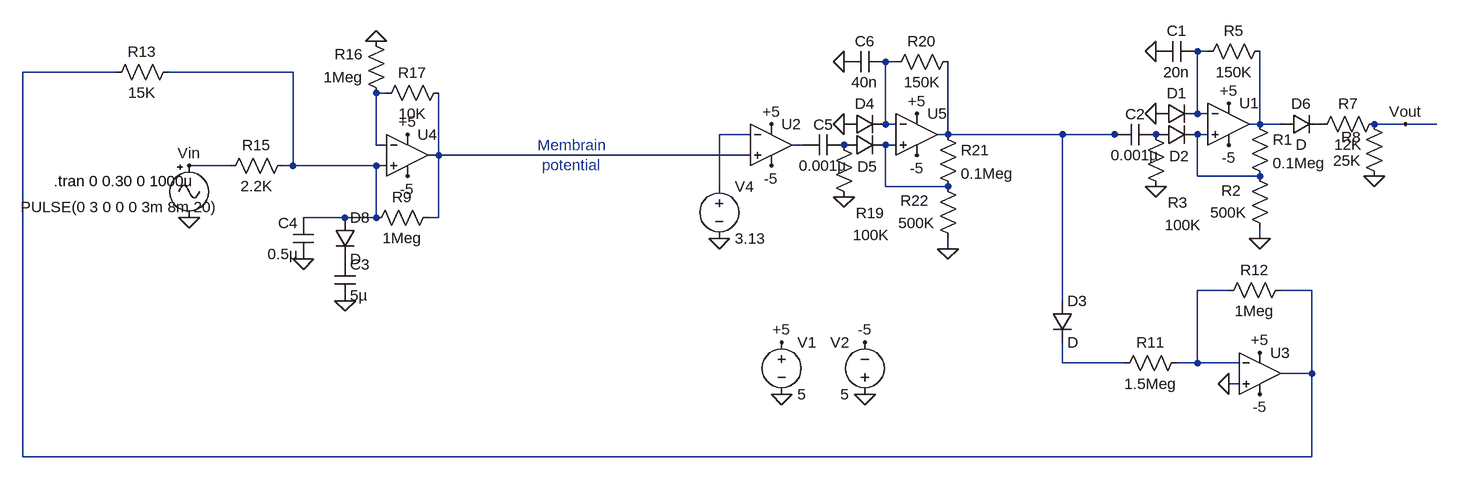
[diagram p0: schematic Leak-5_normal_7ms_capacitor_resistor.asc]
Leak-5_normal_7ms_capacitor_resistor.asc, the LTspice schematic file:
Version 4
SHEET 1 2784 1552
WIRE 720 -336 704 -336
WIRE 240 -320 224 -320
WIRE -960 -304 -1104 -304
WIRE -688 -304 -880 -304
WIRE -544 -272 -560 -272
WIRE 704 -240 704 -336
WIRE 720 -240 704 -240
WIRE 224 -224 224 -320
WIRE 240 -224 224 -224
WIRE 800 -224 800 -336
WIRE 800 -224 784 -224
WIRE 832 -224 800 -224
WIRE 1024 -224 976 -224
WIRE 1072 -224 1024 -224
WIRE 16 -208 -32 -208
WIRE 320 -208 320 -320
WIRE 320 -208 304 -208
WIRE 496 -208 320 -208
WIRE 576 -208 496 -208
WIRE 592 -208 576 -208
WIRE 720 -208 704 -208
WIRE -560 -192 -560 -272
WIRE -544 -192 -560 -192
WIRE 96 -192 80 -192
WIRE 240 -192 224 -192
WIRE -464 -176 -464 -272
WIRE -464 -176 -480 -176
WIRE 16 -176 -464 -176
WIRE -784 -160 -848 -160
WIRE -688 -160 -688 -304
WIRE -688 -160 -704 -160
WIRE -560 -160 -688 -160
WIRE -544 -160 -560 -160
WIRE 704 -144 704 -208
WIRE 800 -144 704 -144
WIRE -32 -128 -32 -208
WIRE 224 -128 224 -192
WIRE 320 -128 224 -128
WIRE -608 -80 -672 -80
WIRE -560 -80 -560 -160
WIRE -560 -80 -608 -80
WIRE -464 -80 -464 -176
WIRE -464 -80 -480 -80
WIRE 800 -48 800 -64
WIRE 320 -32 320 -48
WIRE 752 32 704 32
WIRE 880 32 832 32
WIRE 496 48 496 -208
WIRE 496 144 496 112
WIRE 592 144 496 144
WIRE 704 144 704 32
WIRE 704 144 672 144
WIRE 768 144 704 144
WIRE 880 160 880 32
WIRE 880 160 832 160
WIRE 768 176 752 176
WIRE -1104 288 -1104 -304
WIRE 880 288 880 160
WIRE 880 288 -1104 288
FLAG -848 -80 0
FLAG 272 -240 +5
FLAG 272 -176 -5
FLAG 160 -224 0
FLAG 160 -320 0
FLAG 160 -112 0
FLAG 320 -32 0
FLAG -512 -208 +5
FLAG -512 -144 -5
FLAG -672 -16 0
FLAG -560 -352 0
FLAG 64 192 0
FLAG 192 192 0
FLAG 192 112 -5
FLAG 64 112 +5
FLAG 48 -224 +5
FLAG 48 -160 -5
FLAG 752 -256 +5
FLAG 752 -192 -5
FLAG 640 -240 0
FLAG 640 -336 0
FLAG 640 -128 0
FLAG 800 -48 0
FLAG 976 -144 0
FLAG -848 -160 Vin
FLAG 1024 -224 Vout
FLAG 800 128 +5
FLAG 800 192 -5
FLAG 752 176 0
FLAG -32 -48 0
FLAG -608 48 0
SYMBOL res -688 -176 R90
WINDOW 0 0 56 VBottom 2
WINDOW 3 32 56 VTop 2
SYMATTR InstName R15
SYMATTR Value 2.2K
SYMBOL Opamps\\UniversalOpamp2 272 -208 R0
SYMATTR InstName U5
SYMBOL diode 160 -208 R270
WINDOW 0 32 32 VTop 2
WINDOW 3 0 32 Invisible 2
SYMATTR InstName D4
SYMBOL diode 160 -176 R270
WINDOW 0 -33 36 VTop 2
WINDOW 3 0 32 Invisible 2
SYMATTR InstName D5
SYMBOL res 304 -224 R0
SYMATTR InstName R21
SYMATTR Value 0.1Meg
SYMBOL res 336 -32 R180
WINDOW 0 45 74 Left 2
WINDOW 3 36 40 Left 2
SYMATTR InstName R22
SYMATTR Value 500K
SYMBOL res 144 -208 R0
WINDOW 0 34 121 Left 2
WINDOW 3 30 155 Left 2
SYMATTR InstName R19
SYMATTR Value 100K
SYMBOL res 336 -336 R90
WINDOW 0 0 56 VBottom 2
WINDOW 3 32 56 VTop 2
SYMATTR InstName R20
SYMATTR Value 150K
SYMBOL cap 224 -336 R90
WINDOW 0 0 32 VBottom 2
WINDOW 3 32 32 VTop 2
SYMATTR InstName C6
SYMATTR Value 40n
SYMBOL cap 160 -208 R90
WINDOW 0 0 32 VBottom 2
WINDOW 3 32 32 VTop 2
SYMATTR InstName C5
SYMATTR Value 0.001µ
SYMBOL Opamps\\UniversalOpamp2 -512 -176 R0
SYMATTR InstName U4
SYMBOL cap -656 -16 R180
WINDOW 0 24 56 Left 2
WINDOW 3 24 8 Left 2
SYMATTR InstName C4
SYMATTR Value 0.5µ
SYMBOL res -448 -288 R90
WINDOW 0 0 56 VBottom 2
WINDOW 3 32 56 VTop 2
SYMATTR InstName R17
SYMATTR Value 10K
SYMBOL res -544 -256 R180
WINDOW 0 36 76 Left 2
WINDOW 3 36 40 Left 2
SYMATTR InstName R16
SYMATTR Value 1Meg
SYMBOL voltage 64 96 R0
WINDOW 123 0 0 Left 2
WINDOW 39 0 0 Left 2
SYMATTR InstName V1
SYMATTR Value 5
SYMBOL voltage 192 208 R180
WINDOW 0 24 96 Left 2
WINDOW 3 24 16 Left 2
WINDOW 123 0 0 Left 2
WINDOW 39 0 0 Left 2
SYMATTR InstName V2
SYMATTR Value 5
SYMBOL Misc\\signal -848 -176 R0
WINDOW 0 24 16 Invisible 2
WINDOW 3 -259 80 Left 2
WINDOW 123 0 0 Left 2
WINDOW 39 0 0 Left 2
SYMATTR InstName V3
SYMATTR Value PULSE(0 3 0 0 0 3m 8m 20)
SYMBOL Opamps\\UniversalOpamp2 48 -192 R0
SYMATTR InstName U2
SYMBOL Opamps\\UniversalOpamp2 752 -224 R0
SYMATTR InstName U1
SYMBOL diode 640 -224 R270
WINDOW 0 32 32 VTop 2
WINDOW 3 0 32 Invisible 2
SYMATTR InstName D1
SYMBOL diode 640 -192 R270
WINDOW 0 -33 36 VTop 2
WINDOW 3 0 32 Invisible 2
SYMATTR InstName D2
SYMBOL res 784 -240 R0
SYMATTR InstName R1
SYMATTR Value 0.1Meg
SYMBOL res 816 -48 R180
WINDOW 0 45 74 Left 2
WINDOW 3 36 40 Left 2
SYMATTR InstName R2
SYMATTR Value 500K
SYMBOL res 624 -224 R0
WINDOW 0 34 121 Left 2
WINDOW 3 30 155 Left 2
SYMATTR InstName R3
SYMATTR Value 100K
SYMBOL res 816 -352 R90
WINDOW 0 0 56 VBottom 2
WINDOW 3 32 56 VTop 2
SYMATTR InstName R5
SYMATTR Value 150K
SYMBOL cap 704 -352 R90
WINDOW 0 0 32 VBottom 2
WINDOW 3 32 32 VTop 2
SYMATTR InstName C1
SYMATTR Value 20n
SYMBOL cap 640 -224 R90
WINDOW 0 0 32 VBottom 2
WINDOW 3 32 32 VTop 2
SYMATTR InstName C2
SYMATTR Value 0.001µ
SYMBOL diode 832 -208 R270
WINDOW 0 32 32 VTop 2
WINDOW 3 0 32 VBottom 2
SYMATTR InstName D6
SYMBOL res 992 -240 R90
WINDOW 0 0 56 VBottom 2
WINDOW 3 32 56 VTop 2
SYMATTR InstName R7
SYMATTR Value 12K
SYMBOL res 992 -128 R180
WINDOW 0 36 76 Left 2
WINDOW 3 36 40 Left 2
SYMATTR InstName R8
SYMATTR Value 25K
SYMBOL res -464 -96 R90
WINDOW 0 0 56 VBottom 2
WINDOW 3 32 56 VTop 2
SYMATTR InstName R9
SYMATTR Value 1Meg
SYMBOL diode 480 48 R0
SYMATTR InstName D3
SYMBOL res 688 128 R90
WINDOW 0 0 56 VBottom 2
WINDOW 3 32 56 VTop 2
SYMATTR InstName R11
SYMATTR Value 1.5Meg
SYMBOL Opamps\\UniversalOpamp2 800 160 R0
SYMATTR InstName U3
SYMBOL res 848 16 R90
WINDOW 0 0 56 VBottom 2
WINDOW 3 32 56 VTop 2
SYMATTR InstName R12
SYMATTR Value 1Meg
SYMBOL res -864 -320 R90
WINDOW 0 0 56 VBottom 2
WINDOW 3 32 56 VTop 2
SYMATTR InstName R13
SYMATTR Value 15K
SYMBOL voltage -32 -144 R0
WINDOW 123 0 0 Left 0
WINDOW 39 0 0 Left 0
SYMATTR InstName V4
SYMATTR Value 3.13
SYMBOL cap -624 -16 R0
SYMATTR InstName C3
SYMATTR Value 5µ
SYMBOL diode -624 -80 R0
SYMATTR InstName D8
TEXT -1056 -136 Left 2 !.tran 0 0.30 0 1000u
TEXT -312 -192 Left 2 ;Membrain\n potential

The netlist it stands for:
* Leak-5_normal_7ms_capacitor_resistor.asc
R15 N004 Vin 2.2K
XU5 N011 N002 +5 -5 N008 level.2 Avol=1Meg GBW=10Meg Slew=10Meg ilimit=25m rail=0 Vos=0 phimargin=45 en=0 enk=0 in=0 ink=0 Rin=500Meg  ; pins IN+ IN- V+ V- OUT
D4 0 N002 D
D5 P001 N011 D
R21 N008 N011 0.1Meg
R22 0 N011 500K
R19 P001 0 100K
R20 N008 N002 150K
C6 N002 0 40n
C5 P001 N010 0.001µ
XU4 N004 N005 +5 -5 N012 level.2 Avol=1Meg GBW=10Meg Slew=10Meg ilimit=25m rail=0 Vos=0 phimargin=45 en=0 enk=0 in=0 ink=0 Rin=500Meg  ; pins IN+ IN- V+ V- OUT
C4 0 N004 0.5µ
R17 N012 N005 10K
R16 N005 0 1Meg
V1 +5 0 5
V2 0 -5 5
V3 Vin 0 PULSE(0 3 0 0 0 3m 8m 20)
XU2 N012 N007 +5 -5 N010 level.2 Avol=1Meg GBW=10Meg Slew=10Meg ilimit=25m rail=0 Vos=0 phimargin=45 en=0 enk=0 in=0 ink=0 Rin=500Meg  ; pins IN+ IN- V+ V- OUT
XU1 N009 N001 +5 -5 N006 level.2 Avol=1Meg GBW=10Meg Slew=10Meg ilimit=25m rail=0 Vos=0 phimargin=45 en=0 enk=0 in=0 ink=0 Rin=500Meg  ; pins IN+ IN- V+ V- OUT
D1 0 N001 D
D2 P002 N009 D
R1 N006 N009 0.1Meg
R2 0 N009 500K
R3 P002 0 100K
R5 N006 N001 150K
C1 N001 0 20n
C2 P002 N008 0.001µ
D6 N006 P003 D
R7 Vout P003 12K
R8 0 Vout 25K
R9 N012 N004 1Meg
D3 N008 N014 D
R11 N013 N014 1.5Meg
XU3 0 N013 +5 -5 N003 level.2 Avol=1Meg GBW=10Meg Slew=10Meg ilimit=25m rail=0 Vos=0 phimargin=45 en=0 enk=0 in=0 ink=0 Rin=500Meg  ; pins IN+ IN- V+ V- OUT
R12 N003 N013 1Meg
R13 N004 N003 15K
V4 N007 0 3.13
C3 P004 0 5µ
D8 N004 P004 D
.model D D
.lib standard.dio
.tran 0 0.30 0 1000u
* Membrain
*  potential
.lib UniversalOpamps2.sub
.backanno
.end